# Altium schematic sheet GSM.SchDoc: GSM
size A4; SheetNumber: 2; SheetTotal: 4
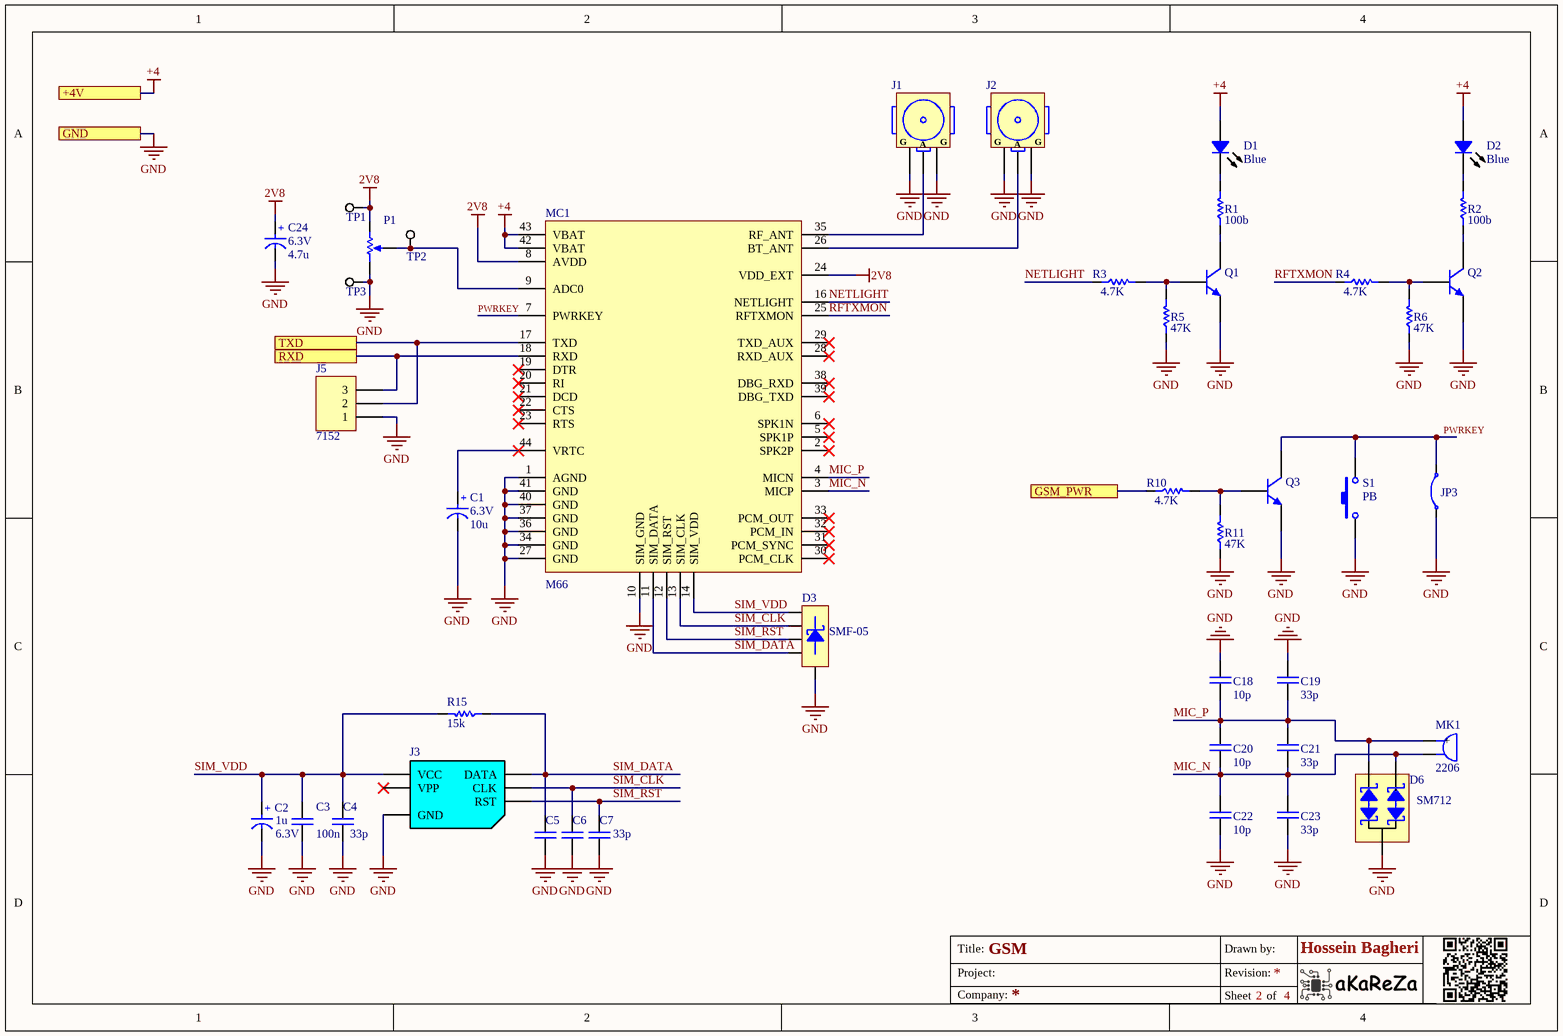
[diagram p0: GSM.SchDoc]

## Parts
C1  Rating: 6.3V  [SMT_C_Tantalum_A]  (hidden comment: 10u)
C2  Rating: 6.3V  [SMT_C_Tantalum_A]  (hidden comment: 1u)
C3  100n  [CAP 0805/2012]
C4  33p  [CAP 0805/2012]
C5  33p  [CAP 0805/2012]  (value not drawn)
C6  33p  [CAP 0805/2012]  (value not drawn)
C7  33p  [CAP 0805/2012]
C18  10p  [CAP 0603/1608]
C19  33p  [CAP 0603/1608]
C20  10p  [CAP 0603/1608]
C21  33p  [CAP 0603/1608]
C22  10p  [CAP 0603/1608]
C23  33p  [CAP 0603/1608]
C24  Rating: 6.3V  [SMT_C_Tantalum_A]  (hidden comment: 4.7u)
D1  Blue  [LED 0805/2012 BLUE]
D2  Blue  [LED 0805/2012 BLUE]
D3  SMF-05  [SC70-5_N]
D6  SM712  [SOT23_M]
J1  U.FL  [IPEX-3x3mm]  (value not drawn)
J2  U.FL  [IPEX-3x3mm]  (value not drawn)
J3  6'Pin  [GCT_SIM8051_Plastik]  (value not drawn)
J5  Inflow: 7152  [HDR_THT_3M_2.54mm]  (hidden comment: 3)
JP3  Jumper  [RESC2012M (0805)]  (value not drawn)
MC1  M66  [m66]
MK1  Inflow: 2206  [mic6]  (hidden comment: Mic)
P1  10K  [Multi turn 01]  (value not drawn)
Q1  NPN  [SOT23_N]  (value not drawn)
Q2  NPN  [SOT23_N]  (value not drawn)
Q3  NPN  [SOT23_N]  (value not drawn)
R1  100b  [RES 0805 (2012X06L)]
R2  100b  [RES 0805 (2012X06L)]
R3  4.7K  [RES 0805 (2012X06L)]
R4  4.7K  [RES 0805 (2012X06L)]
R5  47K  [RES 0805 (2012X06L)]
R6  47K  [RES 0805 (2012X06L)]
R10  4.7K  [RES 0805 (2012X06L)]
R11  47K  [RES 0805 (2012X06L)]
R15  15k  [RES 0805 (2012X06L)]
S1  PB  [SW_PB_SMD_2PIN_SPST_6X3X2]
TP1  TestPoint  [TP_SMD_1x2]  (value not drawn)  (no BOM)
TP2  TestPoint  [TP_SMD_1x2]  (value not drawn)  (no BOM)
TP3  TestPoint  [TP_SMD_1x2]  (value not drawn)  (no BOM)

## Ports
+4V, GND, GSM_PWR, RXD, TXD

## Nets
2V8: C24.1(+) MC1.8(AVDD) MC1.24(VDD_EXT) P1.3 TP1.1(TP)
+4: D1.1 D2.1 MC1.42(VBAT) MC1.43(VBAT) ; port +4V
GND: C1.2(-) C2.2(-) C3.2 C4.2 C5.2 C6.2 C7.2 C18.1 C19.1 C22.2 C23.2 C24.2(-) D3.2(K) D6.3 J1.2(G) J1.3(G) J2.2(G) J2.3(G) J3.5(GND) J5.1 JP3.1 MC1.1(AGND) MC1.10(SIM_GND) MC1.27(GND) MC1.34(GND) MC1.36(GND) MC1.37(GND) MC1.40(GND) MC1.41(GND) P1.1 Q1.2(E) Q2.2(E) Q3.2(E) R5.1 R6.1 R11.1 S1.1 TP3.1(TP) ; port GND
GSM_PWR: R10.1 ; port GSM_PWR
MIC_N: C20.2 C21.2 C22.1 C23.1 D6.2 MC1.3(MICP) MK1.2
MIC_P: C18.2 C19.2 C20.1 C21.1 D6.1 MC1.4(MICN) MK1.1(+)
NETLIGHT: MC1.16(NETLIGHT) R3.1
PWRKEY: JP3.2 MC1.7(PWRKEY) Q3.3(C) S1.2
RFTXMON: MC1.25(RFTXMON) R4.1
RXD: J5.3 MC1.18(RXD) ; port RXD
SIM_CLK: C6.1 D3.4(K) J3.3(CLK) MC1.13(SIM_CLK)
SIM_DATA: C5.1 D3.5(K) J3.4(DATA) MC1.11(SIM_DATA) R15.1
SIM_RST: C7.1 D3.1(K) J3.2(RST) MC1.12(SIM_RST)
SIM_VDD: C2.1(+) C3.1 C4.1 D3.3(K) J3.1(VCC) MC1.14(SIM_VDD) R15.2
TXD: J5.2 MC1.17(TXD) ; port TXD
NetC1_1: C1.1(+) MC1.44(VRTC)
NetD1_2: D1.2 R1.2
NetD2_2: D2.2 R2.2
NetJ1_1: J1.1(A) MC1.35(RF_ANT)
NetJ2_1: J2.1(A) MC1.26(BT_ANT)
NetMC1_9: MC1.9(ADC0) P1.2 TP2.1(TP)
NetQ1_1: Q1.1(B) R3.2 R5.2
NetQ1_3: Q1.3(C) R1.1
NetQ2_1: Q2.1(B) R4.2 R6.2
NetQ2_3: Q2.3(C) R2.1
NetQ3_1: Q3.1(B) R10.2 R11.2

Not connected (* = marked no-connect by the designer): J3 6(VPP)*; MC1 2(SPK2P)* 5(SPK1P)* 6(SPK1N)* 19(DTR)* 20(RI)* 21(DCD)* 22(CTS)* 23(RTS)* 28(RXD_AUX)* 29(TXD_AUX)* 30(PCM_CLK)* 31(PCM_SYNC)* 32(PCM_IN)* 33(PCM_OUT)* 38(DBG_RXD)* 39(DBG_TXD)*

## Notes on the sheet
- Title:
- Project:
- Drawn by:
- Revision:
- Hossein Bagheri
- Company:
- Sheet
- of

## Library data of the parts
C1 C2 C24 = Cap_Tantalum: Tantalum Capacitor,TAJ Series-SMD; Inflow: inflow?; Validation: Valid; Package: Package?; Type: Tantalum
  C1: Value: 10u
  C2: Value: 1u
  C24: Value: 4.7u
C3 = Cap_Multi_SMD_100nF_0805: Bipolar ceramic capacitor SMD; Inflow: inflow?; Type: MultiLayer; Rating: 50V; Validation: Valid; Package: 0805; Value: 100n
C4-C7 = Cap_Multi_SMD_0805: Bipolar ceramic capacitor SMD; Inflow: inflow?; Type: MultiLayer; Rating: Rating?; Validation: Valid; Package: 0805; Value: 33p
C18-C23 = Cap_Multi_SMD: Bipolar ceramic capacitor SMD; Inflow: inflow?; Type: Type?; Validation: Valid; Rating: Rating?; Package: Package?
  C18 C20 C22: Value: 10p
  C19 C21 C23: Value: 33p
D1 D2 = Semi_LED_SMD: LED; Inflow: inflow?; Rating: Rating?; Validation: Valid; Package: Package?; Type: LED; Value: Blue
D3 = Semi_Diod_TVS_SMF05: TVS Diode Array; Rating: Rating?; Validation: Valid; Inflow: inflow?; Type: TVS; Value: SMF-05; Package: SC70-5
D6 = Semi_Diod_TVS_SM712: TVS, ESD PROTECT, 2CH, 400W/17A PP, 7.5VBR, ±8KV ESDmin; Rating: Rating?; Type: Type?; Validation: Valid; Inflow: inflow?; Value: SM712; Package: Package?
J1 J2 = Con_RF_U.FL: Rating: Rating?; Inflow: inflow?; Validation: NT; Type: RF; Package: SMD; Value: U.FL
J3 = Con_Socket_SimCard_1: Nano SimCard Holder 6P; Rating: Rating?; Validation: Valid; Inflow: inflow?; Package: SMD; Type: Nano; Value: 6'Pin
J5 = Con_MPH_3x1_V_THT_2.54: Header, single row, 3 pin; Rating: Rating?; Validation: NT; Value: 3; Package: Package?; Type: Type?
JP3 = Other_Elec_Jumper_0805: Jumper Component; Rating: Rating?; Inflow: inflow?; Validation: Valid; Type: Type?; Package: 0805; Value: Jumper
MC1 = ModSen_Com_M66: Quectel GSM/GPRS Module; Rating: Rating?; Validation: Valid; Inflow: inflow?; Package: Dip; Value: M66; Type: GSM-GPRS
MK1 = Other_Elec_Microphone: Microphone; Rating: Rating?; Validation: NT; Value: Mic; Package: Package?; Type: Type?
P1 = Res_Multi: Multi Turn; Rating: Rating?; Validation: Valid; Inflow: inflow?; Package: Package?; Type: Type?; Value: 10K
Q1-Q3 = Semi_BJT_BC817: NPN General purpose Transistor; Rating: Rating?; Type: Type?; Validation: Valid; Inflow: inflow?; Value: NPN; Package: Package?
R1-R6 R10 R11 R15 = Res_SMD_0805: Resistor; Inflow: inflow?; Rating: 0.125W; Validation: Valid; Package: 0805; Type: 10%
  R1 R2: Value: 100b
  R3 R4 R10: Value: 4.7K
  R5 R6 R11: Value: 47K
  R15: Value: 15k
S1 = SW_PushButton_2_SMD: SMT Tactile ‎Switch; Rating: 2b; Validation: Valid; Inflow: 8260; Type: Vertical; Package: SMD; Value: PB
TP1-TP3 = Other_Elec_TP_SMD: Test Point; Rating: Rating?; Validation: NT; Inflow: inflow?; Value: TestPoint; Package: Package?; Type: Type?